# Altium schematic sheet input_filter.SchDoc
size A4; Author: Mikołaj Pichita; CompanyName: AGH University of Science and Technology; SheetNumber: 4; SheetTotal: 16
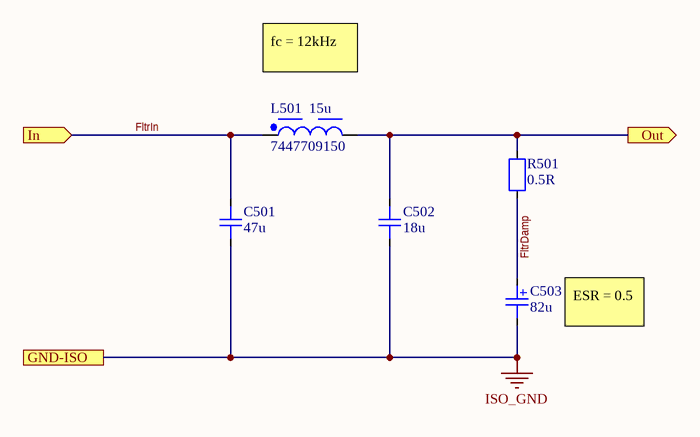
[diagram p0: input_filter.SchDoc]

## Parts
C501  47u  [CAP2220]
C502  18u  [CAP2220]
C503  82u  [WCAP-PSLC_D8H11.7]
L501  7447709150  [WE-PD_1210]
R501  0.5R  [RES0603]

## Ports
GND-ISO (see main[2A], full_bridge[1B], isolator[4B], measurements[1B], output_filter[1B], OV_OC[1B], power_supply[3B], testpoint[1A], voltage_sense[1A]), In (in, see main[2A]), Out (out, see main[2A])

## Nets
ISO_GND: C501.2 C502.2 C503.2 ; port GND-ISO
FltrDamp: C503.1 R501.2
FltrIn: C501.1 L501.1 ; port In
Out: C502.1 L501.2 R501.1 ; port Out

## Notes on the sheet
- fc = 12kHz
- (near L501) 15u
- (near C503) ESR = 0.5
- Nazwa projektu
- Nazwa dokumentu
- Nazwa firmy:
- Autor:
- Osoba sprawdzająca:
- Data:

## Library data of the parts
C501 = Capacitor: 810-C5750X7R1V476M23; Value: *; HelpURL: *; MPN: *; Supplier: *; SupplierPartNumber: *; Supplier 1: Mouser; Supplier Part Number 1: 810-C5750X7R1V476M23
C502 = Capacitor: 80-C2220C156K5R; Value: *; HelpURL: *; MPN: *; Supplier: *; SupplierPartNumber: *; Supplier 1: Mouser; Supplier Part Number 1: 80-C2220C156K5R
C503 = Capacitor: Value: *; HelpURL: *; MPN: *; Supplier: *; SupplierPartNumber: *; Supplier 1: Mouser; Supplier Part Number 1: 710-875115652006
L501 = CMP-0227-00106-2: NexarPartId: 8917162; Max DC Current: 6.5A; Series Resistance: 26mΩ; Inductance: 15µH; Test Frequency: 1kHz; Core Material: Ferrite; Tolerance: 20%; Shielding: Shielded; Self Resonant Frequency: 17MHz; DC Resistance (DCR): 21mΩ; Saturation Current: 8A; Case/Package: Nonstandard; Composition: Wirewound; Case Code (Imperial): 1210; Width: 12mm; Termination: SMD/SMT; Resistance: 26mΩ; Max Operating Temperature: 125°C; Weight: 9.071847g; Min Operating Temperature: -40°C; Current Rating: 6.5A; Lead Free: Lead Free; Depth: 12mm; Mount: Surface Mount; Height - Seated (Max): 10.0076mm; Packaging: Cut Tape (CT); Case Code (Metric): 3225; Length: 12mm; Ambient Temperature Range High: 85°C; REACH SVHC: Unknown; Ambient Temperature Range Low: -40°C; Lead Pitch: 7mm; RoHS: Compliant; Number of Pins: 2; Inductance Tolerance: 20%; Height: 10mm; RMS Current (Irms): 6.5A
R501 = Resistor: Value: *; HelpURL: *; MPN: *; Supplier: *; SupplierPartNumber: *; Supplier 1: Mouser; Supplier Part Number 1: 71-RCWE0603R500FKEA